# EasyEDA schematic SCH_Cowboy-key_2022-04-16.json
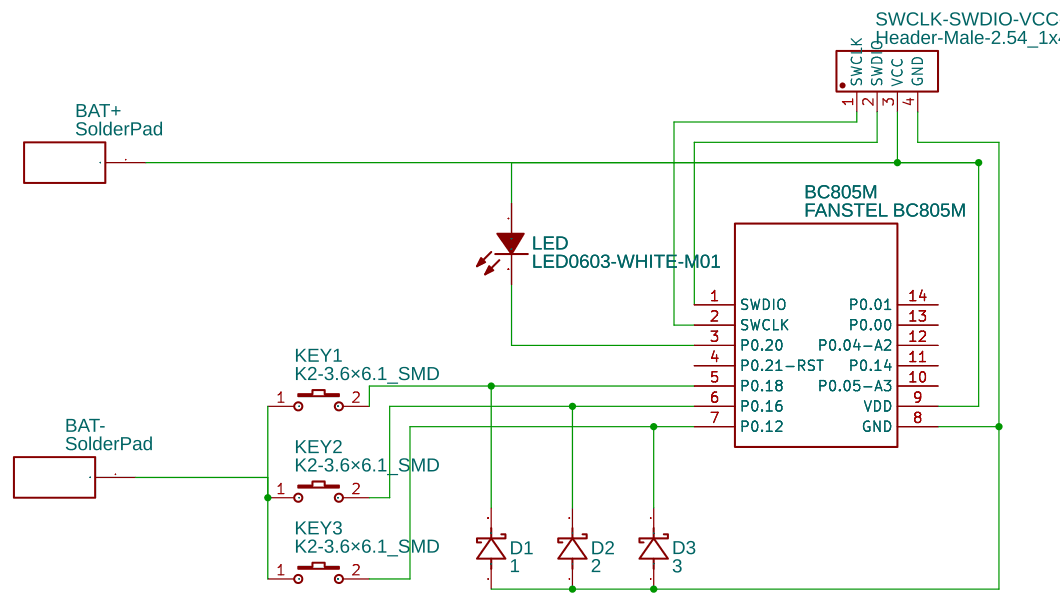
[diagram p0: schematic sheet]

## Parts
BAT+  SolderPad  [SOLDERPAD]
BAT-  SolderPad  [SOLDERPAD]
BC805M  FANSTEL BC805M  [FANSTEL BC805M]
D1  1  [SMA_L4.3-W2.6-LS5.1-R-RD]
D2  2  [SMA_L4.3-W2.6-LS5.1-R-RD]
D3  3  [SMA_L4.3-W2.6-LS5.1-R-RD]
KEY1  K2-3.6×6.1_SMD  [KEY-SMD_2P-L6.2-W3.6-LS8.0]
KEY2  K2-3.6×6.1_SMD  [KEY-SMD_2P-L6.2-W3.6-LS8.0]
KEY3  K2-3.6×6.1_SMD  [KEY-SMD_2P-L6.2-W3.6-LS8.0]
LED  LED0603-WHITE-M01  [LED0603-WHITE-M01]
SWCLK-SWDIO-VCC-GND  Header-Male-2.54_1x4_C59481  [HDR-TH_4P-P2.54-V-M]

## Library data of the parts
BAT+ BAT- = SolderPad: Contributor: bribri.barth; Package Display: No
BC805M = FANSTEL BC805M: Manufacturer: Fanstel; link: https://www.fanstel.com/bc805; Contributor: rory bladen; Package Display: No
D1-D3 = 1N4007_C2892673: Supplier: LCSC; Supplier Part: C2892673; Manufacturer: YONGYUTAI(永裕泰); Manufacturer Part: 1N4007; Contributor: LCSC; JLCPCB Part Class: Extended Part
KEY1-KEY3 = K2-3.6×6.1_SMD: Supplier Part: C118141; Supplier: LCSC; Manufacturer Part: K2-1107ST-A4SW-06; Contributor: LCEDA_Lib; 制造商: 韩国韩荣
LED = LED0603-WHITE-M01: Supplier: LCSC; Manufacturer: LITEON; Manufacturer Part: LTW-C191TS5; Contributor: Misal; Supplier Part: C125123; JLCPCB Part Class: Extended Part
SWCLK-SWDIO-VCC-GND = Header-Male-2.54_1x4_C59481: Supplier: LCSC; Manufacturer: ReliaPro; Manufacturer Part: Headers  Pins 1*4P; Supplier Part: C59481; Package Display: No

## Nets
Net-(BAT+-1): BAT+.1 BC805M.9(VDD) LED.1(A) SWCLK-SWDIO-VCC-GND.3(VCC)
Net-(BAT--1): BAT-.1 KEY1.1 KEY2.1 KEY3.1
Net-(BC805M-1): BC805M.1(SWDIO) SWCLK-SWDIO-VCC-GND.2(SWDIO)
Net-(BC805M-2): BC805M.2(SWCLK) SWCLK-SWDIO-VCC-GND.1(SWCLK)
Net-(BC805M-3): BC805M.3(P0.20) LED.2(K)
Net-(BC805M-5): BC805M.5(P0.18) D1.2(K) KEY1.2
Net-(BC805M-6): BC805M.6(P0.16) D2.2(K) KEY2.2
Net-(BC805M-7): BC805M.7(P0.12) D3.2(K) KEY3.2
Net-(BC805M-8): BC805M.8(GND) D1.1(A) D2.1(A) D3.1(A) SWCLK-SWDIO-VCC-GND.4(GND)

Not connected (* = marked no-connect by the designer): BC805M 4(P0.21-RST) 10(P0.05-A3) 11(P0.14) 12(P0.04-A2) 13(P0.00) 14(P0.01)
